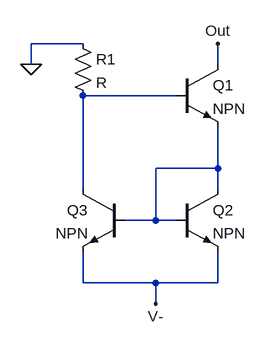
[diagram p0: schematic output_stage_current_mirror.asc]
output_stage_current_mirror.asc, the LTspice schematic file:
Version 4
SHEET 1 880 680
WIRE 48 48 -32 48
WIRE -32 80 -32 48
WIRE 256 80 256 48
WIRE 192 128 48 128
WIRE 256 240 256 176
WIRE 256 240 160 240
WIRE 48 272 48 128
WIRE 256 272 256 240
WIRE 160 320 160 240
WIRE 160 320 112 320
WIRE 192 320 160 320
WIRE 48 416 48 368
WIRE 160 416 48 416
WIRE 256 416 256 368
WIRE 256 416 160 416
WIRE 160 448 160 416
FLAG -32 80 0
FLAG 160 448 V-
FLAG 256 48 Out
SYMBOL npn 192 80 R0
SYMATTR InstName Q1
SYMBOL npn 192 272 R0
SYMATTR InstName Q2
SYMBOL npn 112 272 M0
SYMATTR InstName Q3
SYMBOL res 32 32 R0
SYMATTR InstName R1

The netlist it stands for:
* output_stage_current_mirror.asc
Q1 Out N001 N002 0 NPN
Q2 N002 N002 V- 0 NPN
Q3 N001 N002 V- 0 NPN
R1 0 N001 R
.model NPN NPN
.model PNP PNP
.lib standard.bjt
.backanno
.end